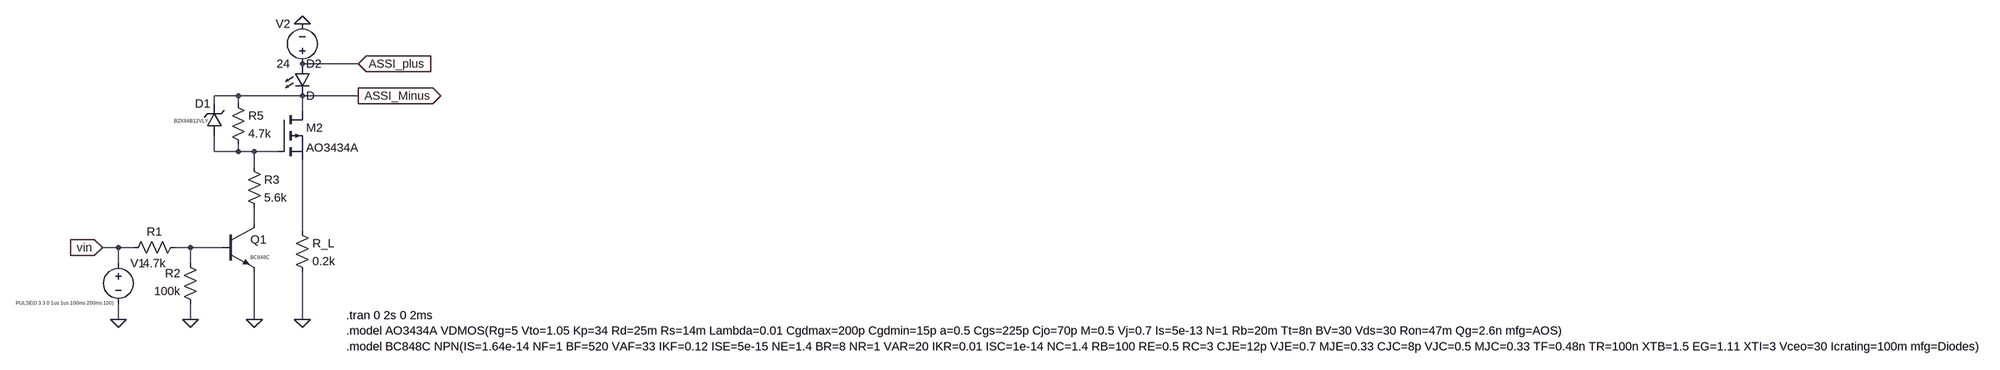
[diagram p0: schematic Simulacion_ASSIs.asc]
Simulacion_ASSIs.asc, the LTspice schematic file:
Version 4
SHEET 1 3796 680
WIRE 592 -224 480 -224
WIRE 352 -160 304 -160
WIRE 480 -160 352 -160
WIRE 592 -160 480 -160
WIRE 304 -144 304 -160
WIRE 352 -144 352 -160
WIRE 480 -128 480 -160
WIRE 304 -48 304 -80
WIRE 352 -48 352 -64
WIRE 352 -48 304 -48
WIRE 384 -48 352 -48
WIRE 432 -48 384 -48
WIRE 384 -16 384 -48
WIRE 384 96 384 64
WIRE 480 112 480 -32
WIRE 112 144 80 144
WIRE 144 144 112 144
WIRE 256 144 224 144
WIRE 320 144 256 144
WIRE 112 176 112 144
WIRE 256 176 256 144
WIRE 112 288 112 256
WIRE 256 288 256 256
WIRE 384 288 384 192
WIRE 480 288 480 192
FLAG 256 288 0
FLAG 112 288 0
FLAG 384 288 0
FLAG 480 288 0
FLAG 80 144 vin
IOPIN 80 144 In
FLAG 480 -304 0
FLAG 592 -224 ASSI_plus
IOPIN 592 -224 In
FLAG 592 -160 ASSI_Minus
IOPIN 592 -160 Out
SYMBOL npn 320 96 R0
WINDOW 3 56 68 Left 0
SYMATTR Value BC848C
SYMATTR InstName Q1
SYMBOL res 240 128 R90
WINDOW 0 0 56 VBottom 2
WINDOW 3 32 56 VTop 2
SYMATTR InstName R1
SYMATTR Value 4.7k
SYMBOL res 272 272 R180
WINDOW 0 36 76 Left 2
WINDOW 3 36 40 Left 2
SYMATTR InstName R2
SYMATTR Value 100k
SYMBOL voltage 112 160 R0
WINDOW 3 -205 96 Left 0
WINDOW 123 0 0 Left 0
WINDOW 39 0 0 Left 0
SYMATTR Value PULSE(0 3.3 0 1us 1us 100ms 200ms 100)
SYMATTR InstName V1
SYMBOL res 368 -32 R0
SYMATTR InstName R3
SYMATTR Value 5.6k
SYMBOL res 336 -160 R0
SYMATTR InstName R5
SYMATTR Value 4.7k
SYMBOL zener 320 -80 R180
WINDOW 0 24 64 Left 2
WINDOW 3 29 29 Left 0
SYMATTR InstName D1
SYMATTR Value BZX84B12VLY
SYMBOL res 464 96 R0
SYMATTR InstName R_L
SYMATTR Value 0.2k
SYMBOL LED 464 -224 R0
SYMATTR InstName D2
SYMBOL voltage 480 -208 R180
WINDOW 0 24 96 Left 2
WINDOW 3 24 16 Left 2
SYMATTR InstName V2
SYMATTR Value 24
SYMBOL pmos 432 -128 R0
SYMATTR InstName M2
SYMATTR Value AO3434A
TEXT 568 280 Left 2 !.tran 0 2s 0 2ms\n.model AO3434A VDMOS(Rg=5 Vto=1.05 Kp=34 Rd=25m Rs=14m Lambda=0.01 Cgdmax=200p Cgdmin=15p a=0.5 Cgs=225p Cjo=70p M=0.5 Vj=0.7 Is=5e-13 N=1 Rb=20m Tt=8n BV=30 Vds=30 Ron=47m Qg=2.6n mfg=AOS)\n.model BC848C NPN(IS=1.64e-14 NF=1 BF=520 VAF=33 IKF=0.12 ISE=5e-15 NE=1.4 BR=8 NR=1 VAR=20 IKR=0.01 ISC=1e-14 NC=1.4 RB=100 RE=0.5 RC=3 CJE=12p VJE=0.7 MJE=0.33 CJC=8p VJC=0.5 MJC=0.33 TF=0.48n TR=100n XTB=1.5 EG=1.11 XTI=3 Vceo=30 Icrating=100m mfg=Diodes)

The netlist it stands for:
* Simulacion_ASSIs.asc
Q1 N002 N004 0 0 BC848C
R1 N004 vin 4.7k
R2 0 N004 100k
V1 vin 0 PULSE(0 3.3 0 1us 1us 100ms 200ms 100)
R3 N001 N002 5.6k
R5 ASSI_Minus N001 4.7k
D1 N001 ASSI_Minus BZX84B12VLY
R_L N003 0 0.2k
D2 ASSI_plus ASSI_Minus D
V2 ASSI_plus 0 24
M2 ASSI_Minus N001 N003 N003 AO3434A
.model D D
.lib standard.dio
.model NPN NPN
.model PNP PNP
.lib standard.bjt
.model NMOS NMOS
.model PMOS PMOS
.lib standard.mos
.tran 0 2s 0 2ms
.model AO3434A VDMOS(Rg=5 Vto=1.05 Kp=34 Rd=25m Rs=14m Lambda=0.01 Cgdmax=200p Cgdmin=15p a=0.5 Cgs=225p Cjo=70p M=0.5 Vj=0.7 Is=5e-13 N=1 Rb=20m Tt=8n BV=30 Vds=30 Ron=47m Qg=2.6n mfg=AOS)
.model BC848C NPN(IS=1.64e-14 NF=1 BF=520 VAF=33 IKF=0.12 ISE=5e-15 NE=1.4 BR=8 NR=1 VAR=20 IKR=0.01 ISC=1e-14 NC=1.4 RB=100 RE=0.5 RC=3 CJE=12p VJE=0.7 MJE=0.33 CJC=8p VJC=0.5 MJC=0.33 TF=0.48n TR=100n XTB=1.5 EG=1.11 XTI=3 Vceo=30 Icrating=100m mfg=Diodes)
.backanno
.end